# Altium schematic sheet Sheet1.SchDoc
size A; SheetNumber: 1; SheetTotal: 1
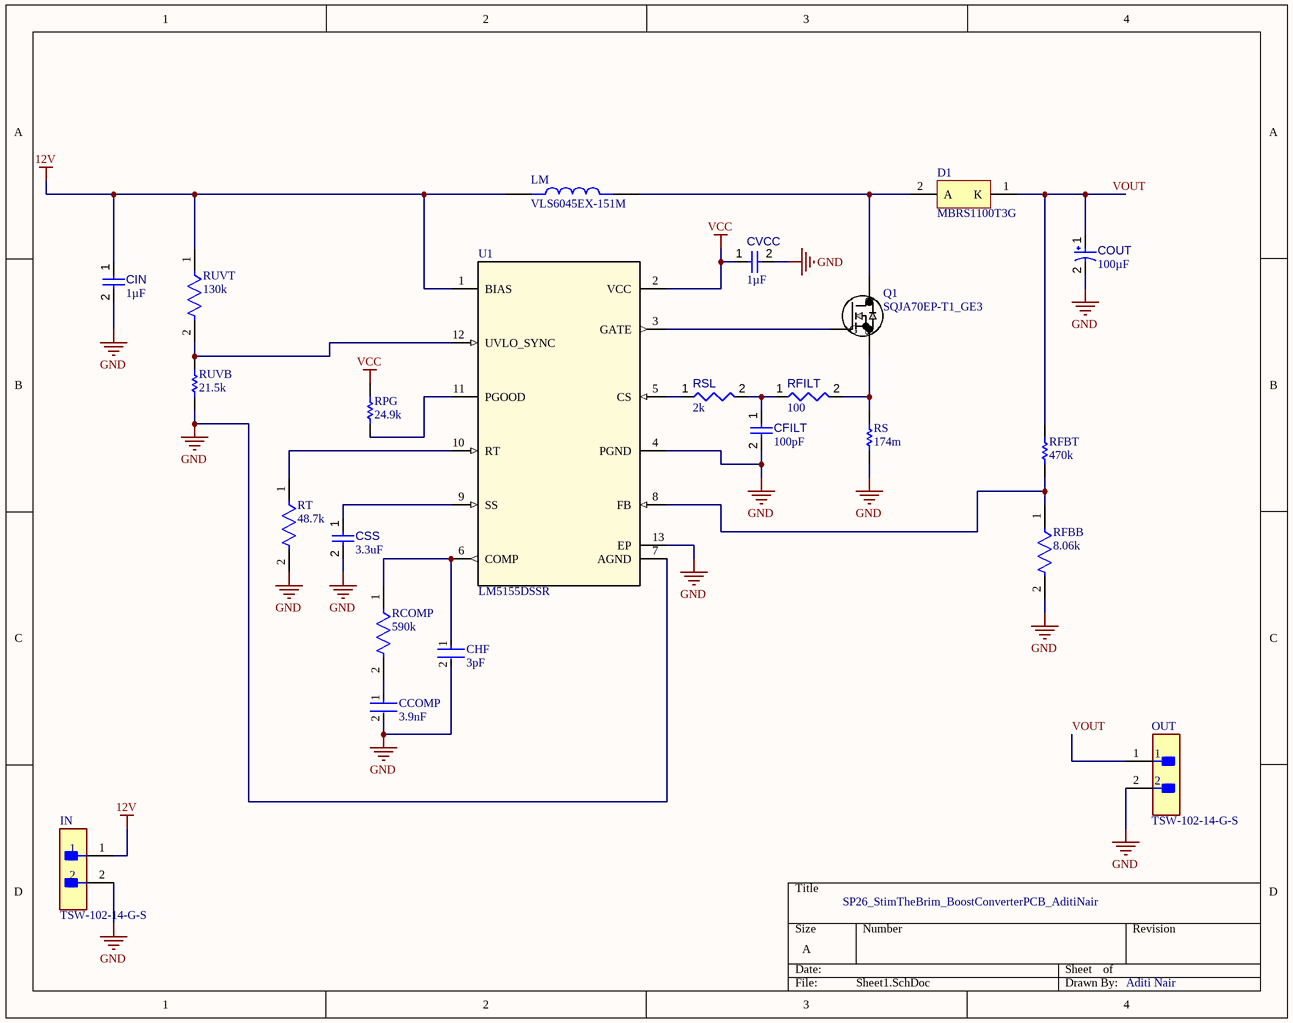
[diagram p0: Sheet1.SchDoc]

## Parts
CCOMP  3.9nF  [FP-C1206C-EB-MFG]
CFILT  100pF  [CAPC0603(1608)100_L]
CHF  3pF  [FP-C0603C-CF-MFG]
CIN  value 1µF  [CAPC1608X90X35ML15T15]  (hidden comment: Capacitor 1uF +/- 10% 16V 0603)
COUT  value 100µF  [CAPPR65-500-1600X1000X1700]  (hidden comment: 100uF)
CSS  value 3.3uF  [CAPC1608X90X35ML15T15]  (hidden comment: Capacitor 1uF +/- 10% 16V 0603)
CVCC  value 1µF  [CAPC1608X90X35ML15T15]  (hidden comment: Capacitor 1uF +/- 10% 16V 0603)
D1  MBRS1100T3G  [ONSC-SMB-2-403A-03_H_V]
IN  TSW-102-14-G-S  [FP-TSW-102-14-G-S-MFG]
LM  VLS6045EX-151M  [IND_VLS6045EX-151M]
OUT  TSW-102-14-G-S  [FP-TSW-102-14-G-S-MFG]
Q1  SQJA70EP-T1_GE3  [SOT_6EP-T1_GE3_VIS]
RCOMP  590k  [FP-TFCR0805-MFG]
RFBB  8.06k  [FP-RK73H1J-MFG]
RFBT  470k  [RESC0603(1608)_N]
RFILT  value 100  [RESC0402(1005)_L]  (hidden comment: Resistor 100R +/-1 % 0402 63 mW)
RPG  24.9k  [RESC1005X40X25NL05T10]
RS  174m  [RESC3116X65X40LL10T20]
RSL  value 2k  [RESC0402(1005)_L]  (hidden comment: Resistor 2K +/-5 % 0402 63 mW)
RT  48.7k  [FP-RN73R1E-IPC_B]
RUVB  21.5k  [RESC0402(1005)_M]
RUVT  130k  [FP-RMCF1206-MFG]
U1  LM5155DSSR  [DSS0012B]

## Nets
12V: CIN.1 IN.1 LM.1 RUVT.1 U1.1(BIAS)
GND: CCOMP.2 CFILT.2 CHF.2 CIN.2 COUT.2 CSS.2 CVCC.2 IN.2 OUT.2 RFBB.2 RS.1 RT.2 RUVB.2 U1.4(PGND) U1.7(AGND) U1.13(EP)
VCC: CVCC.1 RPG.2 U1.2(VCC)
VOUT: COUT.1 D1.1(K) OUT.1 RFBT.1
NetCCOMP_1: CCOMP.1 RCOMP.2
NetCFILT_1: CFILT.1 RFILT.1 RSL.2
NetCHF_1: CHF.1 RCOMP.1 U1.6(COMP)
NetCSS_1: CSS.1 U1.9(SS)
NetD1_2: D1.2(A) LM.2 Q1.5(D)
NetQ1_2: Q1.2(S) RFILT.2 RS.2
NetQ1_4: Q1.4(G) U1.3(GATE)
NetRFBB_1: RFBB.1 RFBT.2 U1.8(FB)
NetRPG_1: RPG.1 U1.11(PGOOD)
NetRSL_1: RSL.1 U1.5(CS)
NetRT_1: RT.1 U1.10(RT)
NetRUVB_1: RUVB.1 RUVT.2 U1.12(UVLO_SYNC)

## Notes on the sheet
- SP26_StimTheBrim_BoostConverterPCB_AditiNair
- Aditi Nair

## Library data of the parts
CCOMP = CMP-03020-021801-1: C1206 3,900 pF C0G 5.00% 250 V; Manufacturer Part Number: C1206C392JAGACTU; Manufacturer: KEMET; Voltage Rating: 250 V; Tolerance: 0.05; Temperature Coefficient: 15%; Automotive Grade: Grade 0; Temperature Characteristic: C0G; RoHS: TRUE; Device Class L1: Passive Components; ComponentLink2Description: Datasheet; Lead Free: Yes; Device Class L3: Ceramic Capacitors; Octopart: https://octopart.com/c1206c392jagactu-kemet-88376556; Automotive: Yes; Category: Cap; Temperature Range Low: -55°C; Ipc Land Pattern Name: CAPC320160X78; Temperature: -55°C to +150°C; Value: 3,900 pF; Height: 0.88mm; Device Class L2: Capacitors; Mouser Description: Multilayer Ceramic Capacitors MLCC - SMD/SMT 250volts 3.9nF 5% C0G; ComponentLink2URL: https://content.kemet.com/datasheets/KEM_C1007_X8R_ULTRA_150C_SMD.pdf; Temperature Range High: +150°C; Capacitance: 3,900 pF; Material: Ceramic; Package: C1206C-EB
CFILT = CMP-001-00076-4: Chip Capacitor, 4.7µF +/-20%, 10V, 0603, Thickness 1 mm; Tolerance: 10%; Mounting Technology: SMT; Case/Package: 0603; Pins: 2; Min Operating Temperature: -55°C; Max Operating Temperature: 85°C; Value: 100pF; Voltage Rating: 10V
CHF = CMP-03020-033445-1: CAP CER 3PF 50V NP0 0603; Manufacturer Part Number: C0603C309D5GAC7867; Manufacturer: KEMET; Temperature Coefficient: 30ppm/°C; Automotive Grade: Grade 1; Value: 3.0 pF; Temperature Characteristic: C0G; Tolerance: 0.5 pF; Temperature Range Low: -55°C; Digikey Description: CAP CER 3PF 50V NP0 0603; Temperature: -55°C to +125°C; Material: Ceramic; Device Class L2: Capacitors; Octopart: https://octopart.com/c0603c309d5gac7867-kemet-1990531; Device Class L1: Passive Components; Category: Cap; Height: 0.87mm; Device Class L3: Ceramic Capacitors; ComponentLink2URL: https://api.kemet.com/component-edge/download/datasheet/C0603C100J5GACAUTO.pdf; ComponentLink2Description: Datasheet; RoHS: TRUE; Voltage Rating: 50 V; Capacitance: 3.0 pF; Lead Free: Yes; Package: C0603C-CF; Automotive: Yes; Temperature Range High: +125°C
CIN CSS CVCC = CMP-001-00004-6: Chip Capacitor, 1 uF, +/- 10%, 16 V, 0603 (1608 Metric); Capacitor Type: Ceramic; Mounting Technology: SM; RoHS Compliant: True; Min Operating Temperature: -55°C; Case/Package: 0603; Pins: 2; Voltage Rating: 16V; Max Operating Temperature: 125°C; Tolerance: 10%
COUT = CMP-001-00034-7: Aluminum Electrolytic Capacitor, 100 uF, +/- 20%, 100 V, -40 to 85 degC, 2-Pin THD, RoHS, Bulk; Manufacturer: Panasonic; Ripple Current (AC): 350mA; Voltage Rating: 100V; Max Operating Temperature: 85°C; Package Quantity: 200; Package Description: 2-Pin Through Hole Device, Dia 10 mm, Body Length 16 mm; Package Reference: CAPPR65-500-1600X1000X1700; Pins: 2; Case/Package: Radial; Datasheet URL: https://industrial.panasonic.com/cdbs/www-data/pdf/RDF0000/ABA0000C1047.pdf; Manufacturer URL: http://www.panasonic.com/; Mounting Technology: TH; Packaging: Bulk; Min Operating Temperature: -40°C; Capacitor Type: Electrolytic; Datasheet Version: Mar-16; RoHS Compliant: True; Tolerance: 20%; Diameter: 10mm; Ripple Current: 350mA; Lead Pitch: 5mm
D1 = CMP-1055-00351-1: Schottky Power Rectifier, Surface Mount Power Package, 2-Pin SMB, Pb-Free, Tape and Reel; Manufacturer: On Semiconductor; IFSM Max (A): 50; Configuration: Single; PackageDescription: 2-Pin Small Molded Package, J-Bend Lead, Body 4.33 x 3.625 mm; Mounting Technology: Surface Mount; ComponentLink2URL: http://www.onsemi.cn/pub_link/Collateral/MBRS1100T3-D.PDF; PackageReference: SMB-2-403A-03_H; PackageVersion: Rev. H, 05/2011; ComponentLink2Description: Datasheet; PartNumber: MBRS1100T3G; Packing: Tape and Reel; ComponentLink1Description: Manufacturer URL; ComponentLink1URL: http://www.onsemi.com/; RoHS: TRUE; DatasheetVersion: Rev. 10; ComponentLink3Description: Package Specification; ComponentLink3URL: http://www.onsemi.com/pub_link/Collateral/1SMB5913BT3-D.PDF
IN OUT = CMP-02766-001740-1: CONN HEADER VERT 2POS 2.54MM; Number of Positions: 2; Max Current Rating: 7.6A; Gender: Male; Max Voltage Rating (AC): 550V; Contact Mating Length: 0.32inch; REACH SVHC: No SVHC; Width: 2.54mm; Insulation Material: PBT; Contact Shape: Square; Contact Plating: Gold; Min Operating Temperature: -55°C; Contact Material: Bronze; Color: Black; Number of Contacts: 2; Housing Material: Polyester; Orientation: Straight; Flammability Rating: UL94 V-0; Max Operating Temperature: 125°C; Contact Type: Male Pin; Radiation Hardening: No; Termination: Solder; RoHS Compliant: Yes; Lead Free: Lead Free; Fastening Type: Pull; Pitch: 2.54mm; Number of Rows: 1; Series: TSW; Insulation Color: Black; Package Quantity: 1; Connector Type: Header; Length: 5.08mm; Contact Finish - Mating: GOLD; Mount: Through Hole; Housing Color: Black; Depth: 2.54mm; Packaging: Bulk
LM = VLS6045EX-151M: Inductor Power Shielded Wirewound 150uH 20% 100KHz Ferrite 700mA 760mOhm DCR 2424 T/R; MF: TDK; Package: NON STANDARD-2 TDK; Price: None; Check_prices: https://www.snapeda.com/parts/VLS6045EX-151M/TDK/view-part/?ref=eda; Value: *; SnapEDA_Link: https://www.snapeda.com/parts/VLS6045EX-151M/TDK/view-part/?ref=snap; MP: VLS6045EX-151M; Availability: In Stock; Purchase-URL: https://pricing.snapeda.com/search/part/VLS6045EX-151M/?ref=eda
Q1 = SQJA70EP-T1_GE3: N-CHANNEL 100-V (D-S) 175C MOSFET; Manufacturer_Name: Vishay; Copyright: Copyright (C) 2026 Ultra Librarian. All rights reserved.; Manufacturer_Part_Number: SQJA70EP-T1_GE3
RCOMP = CMP-250906-134917-1: RES Thin Film,  8.45kΩ, 0.5%, 0.1W, 25ppm/°C, 0805
RFBB = CMP-04015-089182-1: 8.06kΩ ±0.5% 0.1W Chip Resistor 0603 Thick Film AEC-Q200 Qualified; Voltage Rating: 50V; Power Rating: 100mW; Resistance: 8.06kR; Temperature Coefficient: 100ppm/°C; Min Operating Temperature: -55°C; Width: 0.8mm; Case Code (Metric): 1608; Packaging: Tape and Reel; Height: 0.45mm; Resistor Type: Thick Film; Termination: SMD/SMT; Tolerance: 0.5%; Length: 1.6mm; Case/Package: 0603; RoHS Compliant: Yes; Series: RK73H; Case Code (Imperial): 0603; Voltage Rating (DC): 50V; Lead Free: Lead Free; Package Quantity: 5000; Max Operating Temperature: 155°C
RFBT = CMP-1012-00138-1: 470K 0.1W 5% 0603 (1608 Metric)  SMD; Value: 470000.00 Ohm; Case-Metric: 1608; Case-EIA: 0603; Tolerance: 5 %; Power: 0.1 W; Technology: SMT
RFILT = CMP-009-00167-3: Chip Resistor, 100 Ohms, +/-1 %, 63 mW, -55 to 155 degC, 0402; Power: 63mW; Tolerance: 1%; Min Operating Temperature: -55°C; Case/Package: 0402; Pins: 2; Max Operating Temperature: 155°C
RPG = CMP-2002-07531-1: Part Number: RC0402FR-07249KL; Manufacturer: Yageo / Phycomp
RS = CMP-2003-04964-1: Part Number: RC1206FR-10750RL; Manufacturer: Yageo
RSL = CMP-009-00138-3: Chip Resistor, 2 kOhms, +/-5 %, 63 mW, -55 to 155 degC, 0402; Tolerance: 5%; Power: 63mW; Max Operating Temperature: 155°C; Pins: 2; Min Operating Temperature: -55°C; Case/Package: 0402
RT = CMP-04015-053512-1: 48.7kΩ ±1% 0.063W, 1/16W Chip Resistor 0402 (1005 Metric) Moisture Resistant Thin Film
RUVB = CMP-1011-00658-1: 21K5 0.063W 1% 0402 (1005 Metric)  SMD; Value: 21500.00 Ohm; Case-EIA: 0402; Case-Metric: 1005; Tolerance: 1 %; Power: 0.063 W; Technology: SMT
RUVT = CMP-26527-004485-1: 130kΩ ±5% 0.25W 1206 Thick Film Chip Resistor AEC-Q200 compliant; Max Power Dissipation: 250mW; Temperature Coefficient: 200ppm/°C; Resistance: 130kR; Case/Package: 1206; Radiation Hardening: No; Min Operating Temperature: -55°C; Series: RMCF; Height: 0.028inch; Resistor Type: Thick Film; RoHS Compliant: Yes; Contact Plating: Tin; Case Code (Imperial): 1206; Max Operating Temperature: 155°C; Number of Terminations: 2; Tolerance: 5%; Features: Automotive AEC-Q200; Length: 0.126inch; Packaging: Tape and Reel; Case Code (Metric): 3216; Width: 0.063inch; Lead Free: Lead Free; Mount: Surface Mount
U1 = LM5155DSSR: 2.2-MHz wide VIN, 1.5-A MOSFET driver, non-synchronous boost controller 12-WSON -40 to 125; Manufacturer_Name: Texas Instruments; TYPE: TYPE; RefDes: RefDes; Copyright: Copyright (C) 2025 Ultra Librarian. All rights reserved.; Manufacturer_Part_Number: LM5155DSSR